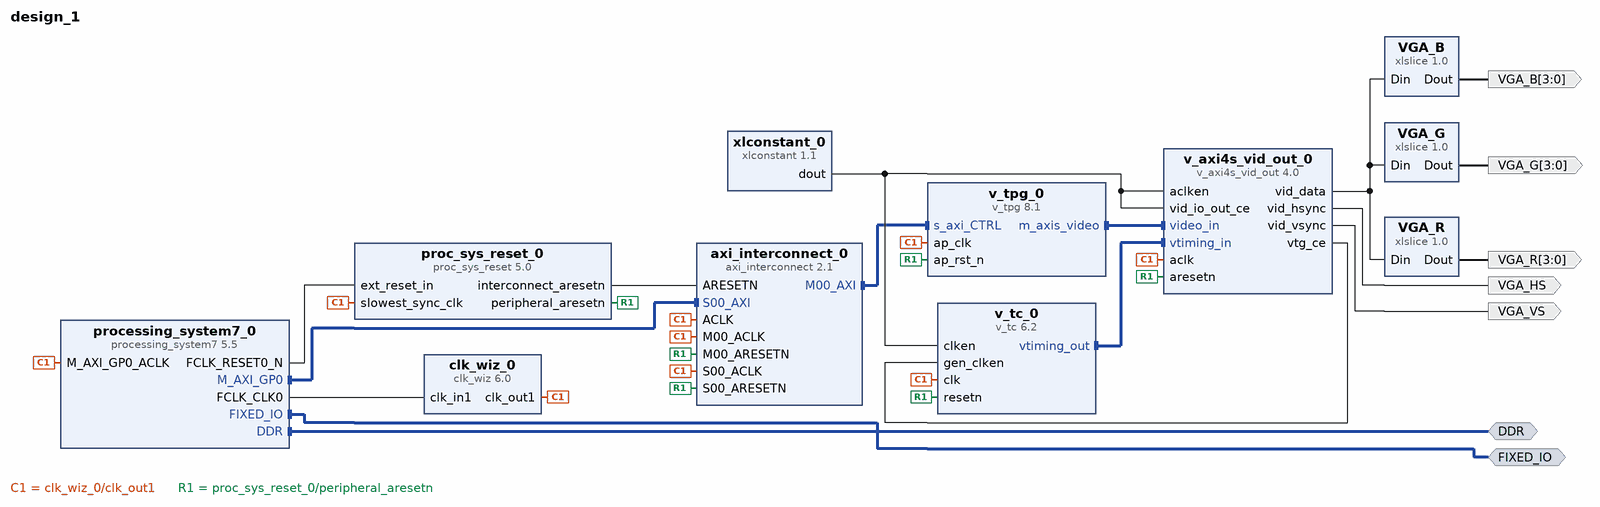
[diagram p0: block diagram of the top level]
# Vivado block design design_1, xc7z020clg484-1, Vivado 2020.2
create_bd_design design_1

create_bd_intf_port -mode Master -vlnv xilinx.com:interface:ddrx_rtl:1.0 DDR
create_bd_intf_port -mode Master -vlnv xilinx.com:display_processing_system7:fixedio_rtl:1.0 FIXED_IO
create_bd_port -dir O VGA_HS
create_bd_port -dir O VGA_VS
create_bd_port -dir O -from 3 -to 0 VGA_B
create_bd_port -dir O -from 3 -to 0 VGA_G
create_bd_port -dir O -from 3 -to 0 VGA_R

create_bd_cell -type ip -vlnv xilinx.com:ip:processing_system7:5.5 processing_system7_0
set_property -dict [list \
  CONFIG.PCW_APU_PERIPHERAL_FREQMHZ 666.666667 \
  CONFIG.PCW_ENET0_ENET0_IO {MIO 16 .. 27} \
  CONFIG.PCW_ENET0_GRP_MDIO_ENABLE 1 \
  CONFIG.PCW_ENET0_GRP_MDIO_IO {MIO 52 .. 53} \
  CONFIG.PCW_ENET0_PERIPHERAL_ENABLE 1 \
  CONFIG.PCW_ENET0_RESET_ENABLE 0 \
  CONFIG.PCW_ENET_RESET_ENABLE 1 \
  CONFIG.PCW_ENET_RESET_SELECT {Share reset pin} \
  CONFIG.PCW_FPGA0_PERIPHERAL_FREQMHZ 100.000000 \
  CONFIG.PCW_FPGA1_PERIPHERAL_FREQMHZ 150.000000 \
  CONFIG.PCW_GPIO_MIO_GPIO_ENABLE 1 \
  CONFIG.PCW_GPIO_MIO_GPIO_IO MIO \
  CONFIG.PCW_I2C_RESET_ENABLE 1 \
  CONFIG.PCW_PRESET_BANK1_VOLTAGE {LVCMOS 1.8V} \
  CONFIG.PCW_QSPI_GRP_SINGLE_SS_ENABLE 1 \
  CONFIG.PCW_QSPI_GRP_SINGLE_SS_IO {MIO 1 .. 6} \
  CONFIG.PCW_QSPI_PERIPHERAL_ENABLE 1 \
  CONFIG.PCW_QSPI_QSPI_IO {MIO 1 .. 6} \
  CONFIG.PCW_SD0_GRP_CD_ENABLE 1 \
  CONFIG.PCW_SD0_GRP_CD_IO {MIO 47} \
  CONFIG.PCW_SD0_GRP_WP_ENABLE 1 \
  CONFIG.PCW_SD0_GRP_WP_IO {MIO 46} \
  CONFIG.PCW_SD0_PERIPHERAL_ENABLE 1 \
  CONFIG.PCW_SD0_SD0_IO {MIO 40 .. 45} \
  CONFIG.PCW_SDIO_PERIPHERAL_FREQMHZ 50 \
  CONFIG.PCW_SINGLE_QSPI_DATA_MODE x4 \
  CONFIG.PCW_TTC0_PERIPHERAL_ENABLE 1 \
  CONFIG.PCW_TTC0_TTC0_IO EMIO \
  CONFIG.PCW_UART1_PERIPHERAL_ENABLE 1 \
  CONFIG.PCW_UART1_UART1_IO {MIO 48 .. 49} \
  CONFIG.PCW_UART_PERIPHERAL_FREQMHZ 50 \
  CONFIG.PCW_UIPARAM_DDR_FREQ_MHZ 533.333313 \
  CONFIG.PCW_UIPARAM_DDR_PARTNO {MT41J128M16 HA-15E} \
  CONFIG.PCW_USB0_PERIPHERAL_ENABLE 1 \
  CONFIG.PCW_USB0_RESET_ENABLE 0 \
  CONFIG.PCW_USB0_USB0_IO {MIO 28 .. 39} \
  CONFIG.PCW_USB_RESET_ENABLE 1 \
  CONFIG.PCW_USB_RESET_SELECT {Share reset pin} \
  CONFIG.preset ZedBoard \
] [get_bd_cells processing_system7_0]
# 223 more settings of processing_system7_0 are not shown: defaults, MIO pin electricals, DDR timing, and values the tool derives
create_bd_cell -type ip -vlnv xilinx.com:ip:proc_sys_reset:5.0 proc_sys_reset_0
create_bd_cell -type ip -vlnv xilinx.com:ip:clk_wiz:6.0 clk_wiz_0
set_property -dict [list \
  CONFIG.CLKOUT1_JITTER 211.552 \
  CONFIG.CLKOUT1_PHASE_ERROR 239.466 \
  CONFIG.CLKOUT1_REQUESTED_OUT_FREQ 148.5 \
  CONFIG.MMCM_CLKFBOUT_MULT_F 37.125 \
  CONFIG.MMCM_CLKOUT0_DIVIDE_F 6.375 \
  CONFIG.MMCM_DIVCLK_DIVIDE 4 \
  CONFIG.USE_LOCKED false \
  CONFIG.USE_RESET false \
] [get_bd_cells clk_wiz_0]
create_bd_cell -type ip -vlnv xilinx.com:ip:axi_interconnect:2.1 axi_interconnect_0
set_property -dict {CONFIG.NUM_MI 1} [get_bd_cells axi_interconnect_0]
create_bd_cell -type ip -vlnv xilinx.com:ip:v_tpg:8.1 v_tpg_0
set_property -dict [list \
  CONFIG.COLOR_BAR 1 \
  CONFIG.COLOR_SWEEP 1 \
  CONFIG.DISPLAY_PORT 1 \
  CONFIG.FOREGROUND 1 \
  CONFIG.HAS_AXI4S_SLAVE 0 \
  CONFIG.HAS_AXI4_YUV422_YUV420 0 \
  CONFIG.RAMP 1 \
  CONFIG.SOLID_COLOR 1 \
  CONFIG.ZONE_PLATE 1 \
] [get_bd_cells v_tpg_0]
create_bd_cell -type ip -vlnv xilinx.com:ip:v_axi4s_vid_out:4.0 v_axi4s_vid_out_0
create_bd_cell -type ip -vlnv xilinx.com:ip:v_tc:6.2 v_tc_0
set_property -dict {CONFIG.HAS_AXI4_LITE false CONFIG.VIDEO_MODE 1080p CONFIG.enable_detection false} [get_bd_cells v_tc_0]
create_bd_cell -type ip -vlnv xilinx.com:ip:xlconstant:1.1 xlconstant_0
create_bd_cell -type ip -vlnv xilinx.com:ip:xlslice:1.0 VGA_B
set_property -dict {CONFIG.DIN_FROM 19 CONFIG.DIN_TO 16 CONFIG.DIN_WIDTH 24 CONFIG.DOUT_WIDTH 4} [get_bd_cells VGA_B]
create_bd_cell -type ip -vlnv xilinx.com:ip:xlslice:1.0 VGA_G
set_property -dict {CONFIG.DIN_FROM 11 CONFIG.DIN_TO 8 CONFIG.DIN_WIDTH 24 CONFIG.DOUT_WIDTH 4} [get_bd_cells VGA_G]
create_bd_cell -type ip -vlnv xilinx.com:ip:xlslice:1.0 VGA_R
set_property -dict {CONFIG.DIN_FROM 3 CONFIG.DIN_WIDTH 24 CONFIG.DOUT_WIDTH 4} [get_bd_cells VGA_R]

# ---- connections ----

connect_bd_intf_net [get_bd_intf_ports FIXED_IO] [get_bd_intf_pins processing_system7_0/FIXED_IO]
connect_bd_intf_net [get_bd_intf_ports DDR] [get_bd_intf_pins processing_system7_0/DDR]
connect_bd_intf_net [get_bd_intf_pins axi_interconnect_0/S00_AXI] [get_bd_intf_pins processing_system7_0/M_AXI_GP0]
connect_bd_intf_net [get_bd_intf_pins v_tpg_0/m_axis_video] [get_bd_intf_pins v_axi4s_vid_out_0/video_in]
connect_bd_intf_net [get_bd_intf_pins v_tc_0/vtiming_out] [get_bd_intf_pins v_axi4s_vid_out_0/vtiming_in]
connect_bd_intf_net [get_bd_intf_pins axi_interconnect_0/M00_AXI] [get_bd_intf_pins v_tpg_0/s_axi_CTRL]
connect_bd_net [get_bd_pins processing_system7_0/FCLK_CLK0] [get_bd_pins clk_wiz_0/clk_in1]
connect_bd_net [get_bd_pins clk_wiz_0/clk_out1] \
  [get_bd_pins proc_sys_reset_0/slowest_sync_clk] [get_bd_pins v_tpg_0/ap_clk] [get_bd_pins axi_interconnect_0/M00_ACLK] \
  [get_bd_pins axi_interconnect_0/S00_ACLK] [get_bd_pins axi_interconnect_0/ACLK] \
  [get_bd_pins processing_system7_0/M_AXI_GP0_ACLK] [get_bd_pins v_tc_0/clk] [get_bd_pins v_axi4s_vid_out_0/aclk]
connect_bd_net [get_bd_pins processing_system7_0/FCLK_RESET0_N] [get_bd_pins proc_sys_reset_0/ext_reset_in]
connect_bd_net [get_bd_pins proc_sys_reset_0/peripheral_aresetn] \
  [get_bd_pins v_tpg_0/ap_rst_n] [get_bd_pins axi_interconnect_0/S00_ARESETN] [get_bd_pins axi_interconnect_0/M00_ARESETN] \
  [get_bd_pins v_tc_0/resetn] [get_bd_pins v_axi4s_vid_out_0/aresetn]
connect_bd_net [get_bd_pins proc_sys_reset_0/interconnect_aresetn] [get_bd_pins axi_interconnect_0/ARESETN]
connect_bd_net [get_bd_pins xlconstant_0/dout] \
  [get_bd_pins v_tc_0/clken] [get_bd_pins v_axi4s_vid_out_0/aclken] [get_bd_pins v_axi4s_vid_out_0/vid_io_out_ce]
connect_bd_net [get_bd_pins v_axi4s_vid_out_0/vtg_ce] [get_bd_pins v_tc_0/gen_clken]
connect_bd_net [get_bd_pins v_axi4s_vid_out_0/vid_hsync] [get_bd_ports VGA_HS]
connect_bd_net [get_bd_pins v_axi4s_vid_out_0/vid_vsync] [get_bd_ports VGA_VS]
connect_bd_net [get_bd_pins v_axi4s_vid_out_0/vid_data] [get_bd_pins VGA_R/Din] [get_bd_pins VGA_G/Din] [get_bd_pins VGA_B/Din]
connect_bd_net -net xlslice_0_Dout [get_bd_pins VGA_B/Dout] [get_bd_ports VGA_B]
connect_bd_net -net xlslice_1_Dout [get_bd_pins VGA_G/Dout] [get_bd_ports VGA_G]
connect_bd_net -net xlslice_2_Dout [get_bd_pins VGA_R/Dout] [get_bd_ports VGA_R]

# ---- address map ----
assign_bd_address -offset 0x43C00000 -range 64K -target_address_space [get_bd_addr_spaces processing_system7_0/Data] [get_bd_addr_segs v_tpg_0/s_axi_CTRL/Reg]

validate_bd_design
save_bd_design
